# Altium schematic sheet fet-adapter.SchDoc
size A
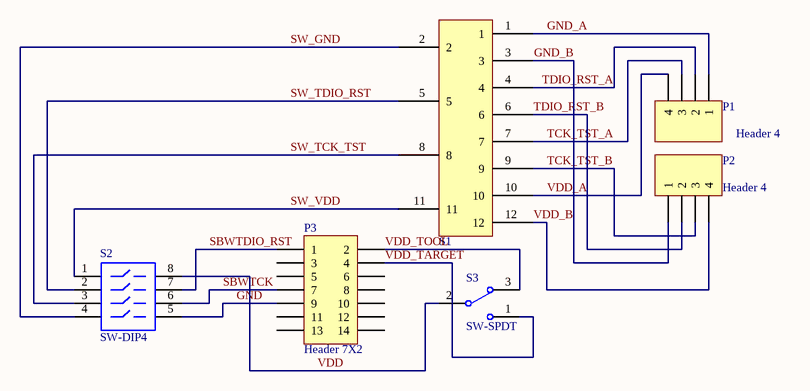
[diagram p0: fet-adapter.SchDoc]

## Parts
P1  Header 4  [HDR1X4]
P2  Header 4  [HDR1X4]
P3  Header 7X2  [JTAG-14PIN]
S1  4PDT  [MFS401N2Z]  (value not drawn)
S2  SW-DIP4  [DIP4PST]
S3  SW-SPDT  [MFS101D15Z]

## Nets
GND: P3.9 S2.5
GND_A: P1.1 S1.1
GND_B: P2.1 S1.3
SBWTCK: P3.7 S2.6
SBWTDIO_RST: P3.1 S2.7
SW_GND: S1.2 S2.4
SW_TCK_TST: S1.8 S2.3
SW_TDIO_RST: S1.5 S2.2
SW_VDD: S1.11 S2.1
TCK_TST_A: P1.3 S1.7
TCK_TST_B: P2.3 S1.9
TDIO_RST_A: P1.2 S1.4
TDIO_RST_B: P2.2 S1.6
VDD: S2.8 S3.2
VDD_A: P1.4 S1.10
VDD_B: P2.4 S1.12
VDD_TARGET: P3.4 S3.1
VDD_TOOL: P3.2 S3.3

Not connected (* = marked no-connect by the designer): P3 3 5 6 8 10 11 12 13 14

## Library data of the parts
P1 P2 = Header 4: Header, 4-Pin; LatestRevisionDate: 17-Jul-2002; LatestRevisionNote: Re-released for DXP Platform.; Publisher: Altium Limited
P3 = Header 7X2: Header, 7-Pin, Dual row; Manufacturer: On Shore Technology Inc.; ManufacturerPartNumber: 302-S141; LatestRevisionDate: 17-Jul-2002; Distributor: Digi-Key; DistributorPartNumber: ED10522-ND
S1 = SW_4PDT: 4PDT Switch; ManufacturerPartNumber: MFS401N-2-Z; Manufacturer: Copal Electronics; Distributor: Digi-Key; DistributorPartNumber: 563-1568-ND
S2 = SW-DIP4: DIP Switch; Manufacturer: Grayhill Inc.; ManufacturerPartNumber: 78H01T; Published: 24-Mar-1999; LatestRevisionDate: 17-Jul-2002; PackageReference: DIP-8; Distributor: Digi-Key; DistributorPartNumber: GH7198-ND
S3 = SW-SPDT: SPDT Subminiature Toggle Switch, Right Angle Mounting, Vertical Actuation; Manufacturer: Copal Electronics; ManufacturerPartNumber: MFS101D-15-Z; Published: 24-Mar-1999; LatestRevisionDate: 17-Dec-2003; DatasheetVersion: 05-Dec-2000; PackageReference: TL36WW15050; PackageDescription: Switch; 4 Leads; ComponentLink1Description: Manufacturer Link; ComponentLink1URL: http://www.apem.com; Distributor: Digi-Key; DistributorPartNumber: 563-1554-ND